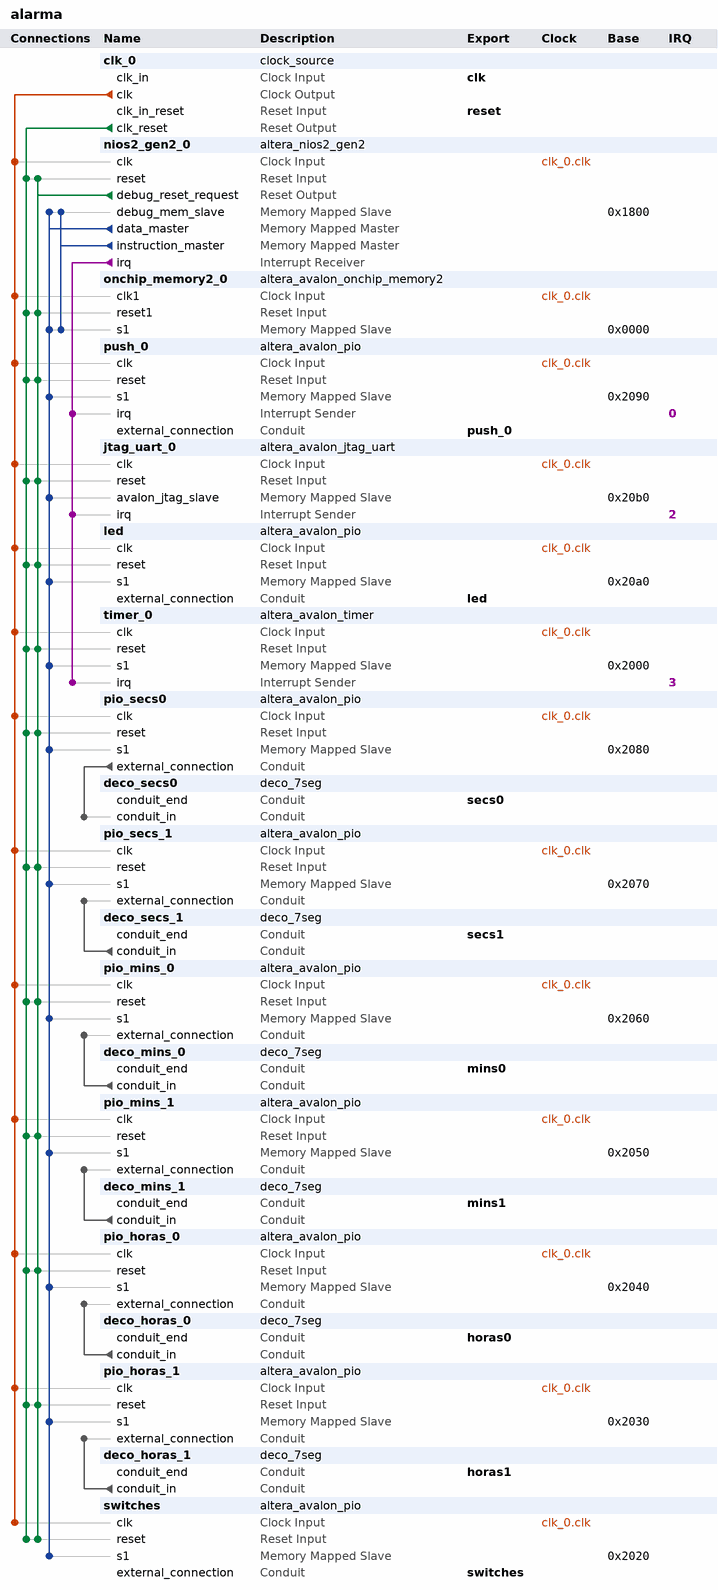
[diagram p0: system contents]
# Platform Designer (Qsys) system alarma, Cyclone V 5CSEMA5F31C6
# Parameters at their usual value, and those the tool derives, are not listed.
package require -exact qsys 19.1
create_system alarma
set_project_property DEVICE_FAMILY {Cyclone V}
set_project_property DEVICE 5CSEMA5F31C6

add_instance clk_0 clock_source 19.1
set_instance_parameter_value clk_0 clockFrequency 50000000

add_instance nios2_gen2_0 altera_nios2_gen2 19.1
set_instance_parameter_value nios2_gen2_0 dcache_size 2048
set_instance_parameter_value nios2_gen2_0 exceptionSlave onchip_memory2_0.s1
set_instance_parameter_value nios2_gen2_0 icache_size 4096
set_instance_parameter_value nios2_gen2_0 impl Tiny
set_instance_parameter_value nios2_gen2_0 resetSlave onchip_memory2_0.s1

add_instance onchip_memory2_0 altera_avalon_onchip_memory2 19.1
set_instance_parameter_value onchip_memory2_0 dataWidth 32
set_instance_parameter_value onchip_memory2_0 dualPort false
set_instance_parameter_value onchip_memory2_0 initMemContent false
set_instance_parameter_value onchip_memory2_0 initializationFileName onchip_mem.hex
set_instance_parameter_value onchip_memory2_0 memorySize 4096

add_instance push_0 altera_avalon_pio 19.1
set_instance_parameter_value push_0 captureEdge true
set_instance_parameter_value push_0 direction Input
set_instance_parameter_value push_0 generateIRQ true
set_instance_parameter_value push_0 irqType EDGE
set_instance_parameter_value push_0 simDoTestBenchWiring true
set_instance_parameter_value push_0 width 1

add_instance jtag_uart_0 altera_avalon_jtag_uart 19.1
set_instance_parameter_value jtag_uart_0 simInteractiveOptions NO_INTERACTIVE_WINDOWS

add_instance led altera_avalon_pio 19.1
set_instance_parameter_value led direction Output
set_instance_parameter_value led width 10

add_instance timer_0 altera_avalon_timer 19.1
set_instance_parameter_value timer_0 fixedPeriod true
set_instance_parameter_value timer_0 period 1
set_instance_parameter_value timer_0 periodUnits SEC

add_instance pio_secs0 altera_avalon_pio 19.1
set_instance_parameter_value pio_secs0 direction Output
set_instance_parameter_value pio_secs0 width 6

add_instance deco_secs0 deco_7seg 1.0

add_instance pio_secs_1 altera_avalon_pio 19.1
set_instance_parameter_value pio_secs_1 direction Output
set_instance_parameter_value pio_secs_1 width 6

add_instance deco_secs_1 deco_7seg 1.0

add_instance pio_mins_0 altera_avalon_pio 19.1
set_instance_parameter_value pio_mins_0 direction Output
set_instance_parameter_value pio_mins_0 width 6

add_instance deco_mins_0 deco_7seg 1.0

add_instance pio_mins_1 altera_avalon_pio 19.1
set_instance_parameter_value pio_mins_1 direction Output
set_instance_parameter_value pio_mins_1 width 6

add_instance deco_mins_1 deco_7seg 1.0

add_instance pio_horas_0 altera_avalon_pio 19.1
set_instance_parameter_value pio_horas_0 direction Output
set_instance_parameter_value pio_horas_0 width 6

add_instance deco_horas_0 deco_7seg 1.0

add_instance pio_horas_1 altera_avalon_pio 19.1
set_instance_parameter_value pio_horas_1 direction Output
set_instance_parameter_value pio_horas_1 width 6

add_instance deco_horas_1 deco_7seg 1.0

add_instance switches altera_avalon_pio 19.1
set_instance_parameter_value switches direction Input
set_instance_parameter_value switches simDoTestBenchWiring true
set_instance_parameter_value switches width 10

# connections
add_connection clk_0.clk jtag_uart_0.clk clock
add_connection clk_0.clk led.clk clock
add_connection clk_0.clk nios2_gen2_0.clk clock
add_connection clk_0.clk onchip_memory2_0.clk1 clock
add_connection clk_0.clk pio_horas_0.clk clock
add_connection clk_0.clk pio_horas_1.clk clock
add_connection clk_0.clk pio_mins_0.clk clock
add_connection clk_0.clk pio_mins_1.clk clock
add_connection clk_0.clk pio_secs0.clk clock
add_connection clk_0.clk pio_secs_1.clk clock
add_connection clk_0.clk push_0.clk clock
add_connection clk_0.clk switches.clk clock
add_connection clk_0.clk timer_0.clk clock
add_connection clk_0.clk_reset jtag_uart_0.reset reset
add_connection clk_0.clk_reset led.reset reset
add_connection clk_0.clk_reset nios2_gen2_0.reset reset
add_connection clk_0.clk_reset onchip_memory2_0.reset1 reset
add_connection clk_0.clk_reset pio_horas_0.reset reset
add_connection clk_0.clk_reset pio_horas_1.reset reset
add_connection clk_0.clk_reset pio_mins_0.reset reset
add_connection clk_0.clk_reset pio_mins_1.reset reset
add_connection clk_0.clk_reset pio_secs0.reset reset
add_connection clk_0.clk_reset pio_secs_1.reset reset
add_connection clk_0.clk_reset push_0.reset reset
add_connection clk_0.clk_reset switches.reset reset
add_connection clk_0.clk_reset timer_0.reset reset
add_connection nios2_gen2_0.debug_reset_request jtag_uart_0.reset reset
add_connection nios2_gen2_0.debug_reset_request led.reset reset
add_connection nios2_gen2_0.debug_reset_request nios2_gen2_0.reset reset
add_connection nios2_gen2_0.debug_reset_request onchip_memory2_0.reset1 reset
add_connection nios2_gen2_0.debug_reset_request pio_horas_0.reset reset
add_connection nios2_gen2_0.debug_reset_request pio_horas_1.reset reset
add_connection nios2_gen2_0.debug_reset_request pio_mins_0.reset reset
add_connection nios2_gen2_0.debug_reset_request pio_mins_1.reset reset
add_connection nios2_gen2_0.debug_reset_request pio_secs0.reset reset
add_connection nios2_gen2_0.debug_reset_request pio_secs_1.reset reset
add_connection nios2_gen2_0.debug_reset_request push_0.reset reset
add_connection nios2_gen2_0.debug_reset_request switches.reset reset
add_connection nios2_gen2_0.debug_reset_request timer_0.reset reset
add_connection nios2_gen2_0.data_master jtag_uart_0.avalon_jtag_slave avalon
set_connection_parameter_value nios2_gen2_0.data_master/jtag_uart_0.avalon_jtag_slave baseAddress 0x20b0
add_connection nios2_gen2_0.data_master led.s1 avalon
set_connection_parameter_value nios2_gen2_0.data_master/led.s1 baseAddress 0x20a0
add_connection nios2_gen2_0.data_master nios2_gen2_0.debug_mem_slave avalon
set_connection_parameter_value nios2_gen2_0.data_master/nios2_gen2_0.debug_mem_slave baseAddress 0x1800
add_connection nios2_gen2_0.data_master onchip_memory2_0.s1 avalon
set_connection_parameter_value nios2_gen2_0.data_master/onchip_memory2_0.s1 baseAddress 0x0000
add_connection nios2_gen2_0.data_master pio_horas_0.s1 avalon
set_connection_parameter_value nios2_gen2_0.data_master/pio_horas_0.s1 baseAddress 0x2040
add_connection nios2_gen2_0.data_master pio_horas_1.s1 avalon
set_connection_parameter_value nios2_gen2_0.data_master/pio_horas_1.s1 baseAddress 0x2030
add_connection nios2_gen2_0.data_master pio_mins_0.s1 avalon
set_connection_parameter_value nios2_gen2_0.data_master/pio_mins_0.s1 baseAddress 0x2060
add_connection nios2_gen2_0.data_master pio_mins_1.s1 avalon
set_connection_parameter_value nios2_gen2_0.data_master/pio_mins_1.s1 baseAddress 0x2050
add_connection nios2_gen2_0.data_master pio_secs0.s1 avalon
set_connection_parameter_value nios2_gen2_0.data_master/pio_secs0.s1 baseAddress 0x2080
add_connection nios2_gen2_0.data_master pio_secs_1.s1 avalon
set_connection_parameter_value nios2_gen2_0.data_master/pio_secs_1.s1 baseAddress 0x2070
add_connection nios2_gen2_0.data_master push_0.s1 avalon
set_connection_parameter_value nios2_gen2_0.data_master/push_0.s1 baseAddress 0x2090
add_connection nios2_gen2_0.data_master switches.s1 avalon
set_connection_parameter_value nios2_gen2_0.data_master/switches.s1 baseAddress 0x2020
add_connection nios2_gen2_0.data_master timer_0.s1 avalon
set_connection_parameter_value nios2_gen2_0.data_master/timer_0.s1 baseAddress 0x2000
add_connection nios2_gen2_0.instruction_master nios2_gen2_0.debug_mem_slave avalon
set_connection_parameter_value nios2_gen2_0.instruction_master/nios2_gen2_0.debug_mem_slave baseAddress 0x1800
add_connection nios2_gen2_0.instruction_master onchip_memory2_0.s1 avalon
set_connection_parameter_value nios2_gen2_0.instruction_master/onchip_memory2_0.s1 baseAddress 0x0000
add_connection deco_horas_0.conduit_in pio_horas_0.external_connection conduit
add_connection deco_horas_1.conduit_in pio_horas_1.external_connection conduit
add_connection deco_mins_0.conduit_in pio_mins_0.external_connection conduit
add_connection deco_mins_1.conduit_in pio_mins_1.external_connection conduit
add_connection deco_secs_1.conduit_in pio_secs_1.external_connection conduit
add_connection pio_secs0.external_connection deco_secs0.conduit_in conduit
add_connection nios2_gen2_0.irq jtag_uart_0.irq interrupt
set_connection_parameter_value nios2_gen2_0.irq/jtag_uart_0.irq irqNumber 2
add_connection nios2_gen2_0.irq push_0.irq interrupt
set_connection_parameter_value nios2_gen2_0.irq/push_0.irq irqNumber 0
add_connection nios2_gen2_0.irq timer_0.irq interrupt
set_connection_parameter_value nios2_gen2_0.irq/timer_0.irq irqNumber 3

# exported interfaces
add_interface clk clock sink
set_interface_property clk EXPORT_OF clk_0.clk_in
add_interface horas0 conduit end
set_interface_property horas0 EXPORT_OF deco_horas_0.conduit_end
add_interface horas1 conduit end
set_interface_property horas1 EXPORT_OF deco_horas_1.conduit_end
add_interface led conduit end
set_interface_property led EXPORT_OF led.external_connection
add_interface mins0 conduit end
set_interface_property mins0 EXPORT_OF deco_mins_0.conduit_end
add_interface mins1 conduit end
set_interface_property mins1 EXPORT_OF deco_mins_1.conduit_end
add_interface push_0 conduit end
set_interface_property push_0 EXPORT_OF push_0.external_connection
add_interface reset reset sink
set_interface_property reset EXPORT_OF clk_0.clk_in_reset
add_interface secs0 conduit end
set_interface_property secs0 EXPORT_OF deco_secs0.conduit_end
add_interface secs1 conduit end
set_interface_property secs1 EXPORT_OF deco_secs_1.conduit_end
add_interface switches conduit end
set_interface_property switches EXPORT_OF switches.external_connection

set_interconnect_requirement {$system} qsys_mm.clockCrossingAdapter HANDSHAKE
set_interconnect_requirement {$system} qsys_mm.enableEccProtection FALSE
set_interconnect_requirement {$system} qsys_mm.insertDefaultSlave FALSE
set_interconnect_requirement {$system} qsys_mm.maxAdditionalLatency 1

save_system alarma.qsys
